# Altium project Rectifier.PrjPcb
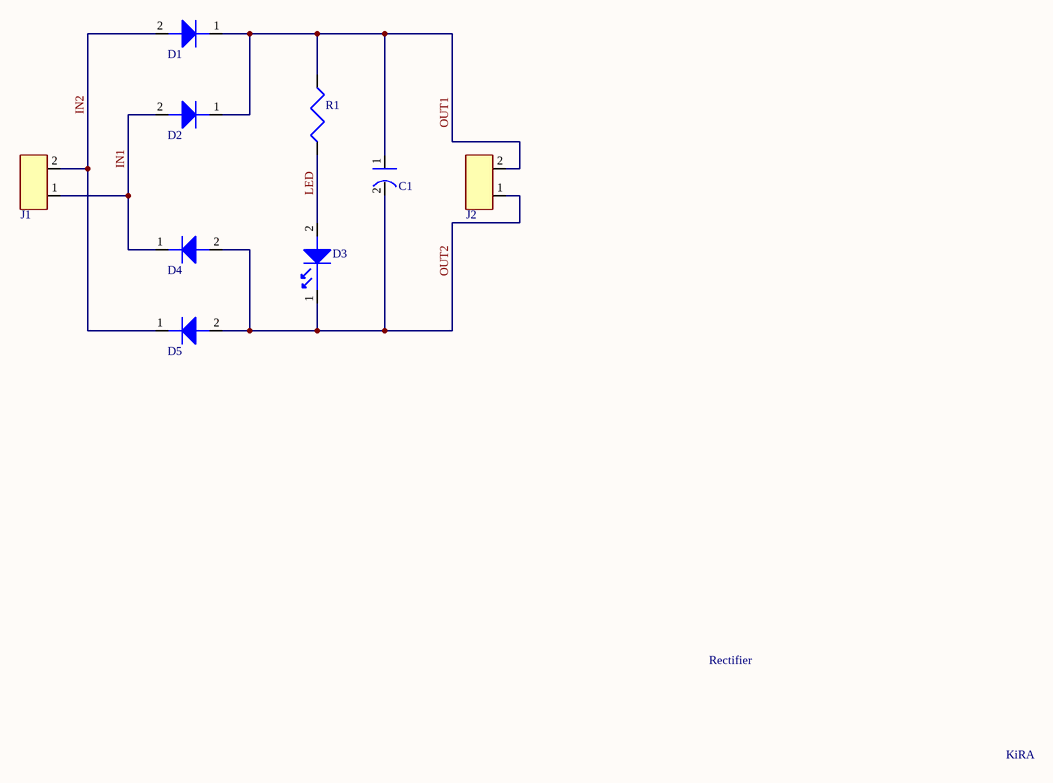
[diagram p0: rectifier.SchDoc]
1 sheet, 9 parts. Net scope: global (net labels, ports and power ports of the same name join across sheets).
Board file: rectifier.PcbDoc

## Sheet rectifier.SchDoc
size A4; SheetNumber: 1; SheetTotal: 1

### Parts
C1  Capacitor 1000uF 25V  [Capacitor 1000uF 25V]  (value not drawn)
D1  Diode  [Diode 1N914]  (value not drawn)
D2  Diode  [Diode 1N914]  (value not drawn)
D3  3mm red LED  [LED 3mm red]  (value not drawn)
D4  Diode  [Diode 1N914]  (value not drawn)
D5  Diode  [Diode 1N914]  (value not drawn)
J1  1X2 header, screw  [Header, Screw]  (value not drawn)
J2  1X2 header, screw  [Header, Screw]  (value not drawn)
R1  10K, 0.25W  [Resistor 10K, 0.25W]  (value not drawn)

### Nets
IN1: D2.2 D4.1 J1.1
IN2: D1.2 D5.1 J1.2
LED: D3.2 R1.1
OUT1: C1.1 D1.1 D2.1 J2.2 R1.2
OUT2: C1.2 D3.1 D4.2 D5.2 J2.1

### Notes on the sheet
- Rectifier
- KiRA

### Library data of the parts
C1 = 108CKR025M: Manufacturer: CKR/CKS; Part No: 108CKR025M; Capacitance: 1000uF; Voltage: 25V
D1 D2 D4 D5 = 1N914: Manufacturer: onsemi; Part No: 1N914
D3 = OVLBR4CL: Manufacturer: TT electronics; Part No: OVLBR4CL; Colour: Red
J1 J2 = 796683-2: header, Screw, PCB mount; Manufacturer: TE Connectivity; Part No: 796683-2
R1 = Resistor: Manufacturer: Yageo Corporation